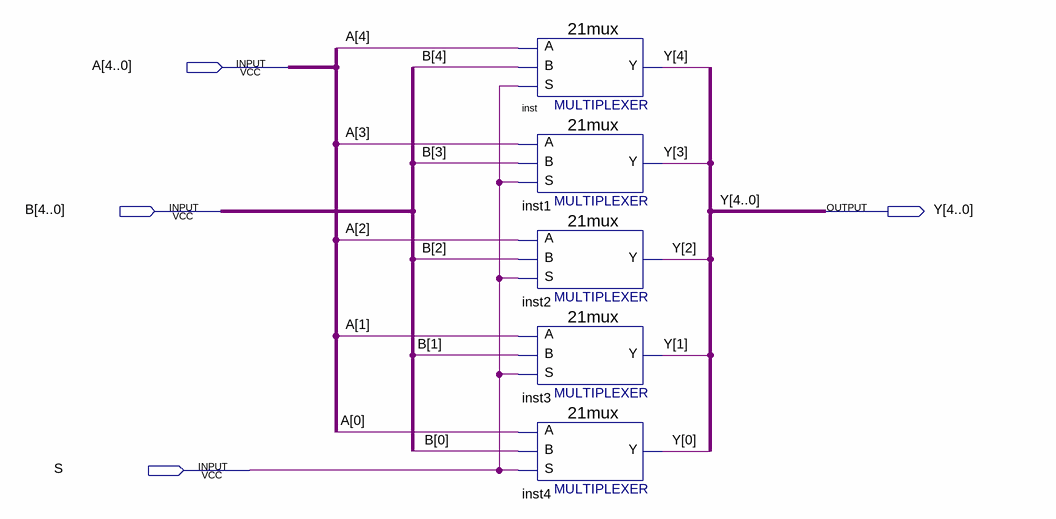
[diagram p0: schematic sheet]
// Quartus schematic selector.bdf as structural Verilog: 5 symbols, 4 pins
module selector (
  input  [4:0] A,
  input  [4:0] B,
  input  S,
  output [4:0] Y
);

  \21mux  inst (.S(S), .B(B[4]), .A(A[4]), .Y(Y[4]));
  \21mux  inst1 (.S(S), .B(B[3]), .A(A[3]), .Y(Y[3]));
  \21mux  inst2 (.S(S), .B(B[2]), .A(A[2]), .Y(Y[2]));
  \21mux  inst3 (.S(S), .B(B[1]), .A(A[1]), .Y(Y[1]));
  \21mux  inst4 (.S(S), .B(B[0]), .A(A[0]), .Y(Y[0]));
endmodule
